# EAGLE schematic pedalElectricalDrawings (EAGLE 7.7.0)
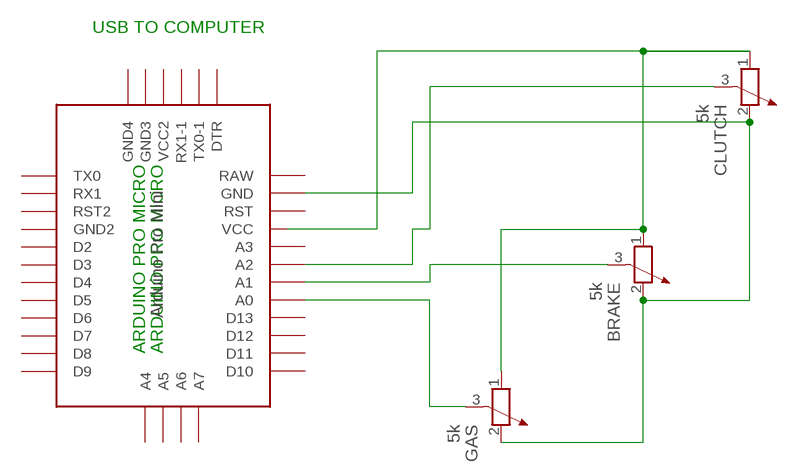
[diagram p0: schematic, sheet 1]

## Parts
BRAKE  5k  POTENTIOMETER_PT-10  [PT-10]
CLUTCH  5k  POTENTIOMETER_PT-10  [PT-10]
GAS  5k  POTENTIOMETER_PT-10  [PT-10]
U$1  PRO-MINI  [PRO-MINI]

## Nets
N$1: GAS.3 U$1.A0
N$2: BRAKE.3 U$1.A1
N$3: CLUTCH.3 U$1.A2
N$4: BRAKE.2 CLUTCH.2 GAS.2 U$1.GND
N$5: BRAKE.1 CLUTCH.1 GAS.1
Unconnected: U$1.A3 U$1.A4 U$1.A5 U$1.A6 U$1.A7 U$1.D2 U$1.D3 U$1.D4 U$1.D5 U$1.D6 U$1.D7 U$1.D8 U$1.D9 U$1.D10 U$1.D11 U$1.D12 U$1.D13 U$1.DTR U$1.GND1(GND2) U$1.GND2(GND4) U$1.GND3 U$1.RST U$1.RST1(RST2) U$1.RX1 U$1.RX1-1 U$1.TX0 U$1.TX0-1 U$1.VCC U$1.VCC1(VCC2)

## Notes on the sheet
- USB TO COMPUTER
- ARDUINO PRO MICRO | ARDUINO PRO MICRO

## Power pins joined to a net without a drawn wire
RAW: U$1.RAW

## Library data of the parts
BRAKE CLUTCH GAS = rcl:POTENTIOMETER_: Potentiometer
U$1 = Arduino-clone:PRO-MINI: Arduion Pro Mini Clone V1.0 www.betemcu.cu